# EAGLE design MintyCharger (Rev A) (EAGLE 7.7.0)
MintyCharger (Rev A)
AUTHOR: Nathan Campos; REVISION: A

## Sheet 1 of 2: Analog Section Contains the entire analog part of the circuit, including sensing, DC/DC boost conversion, and an adjustable DC load.
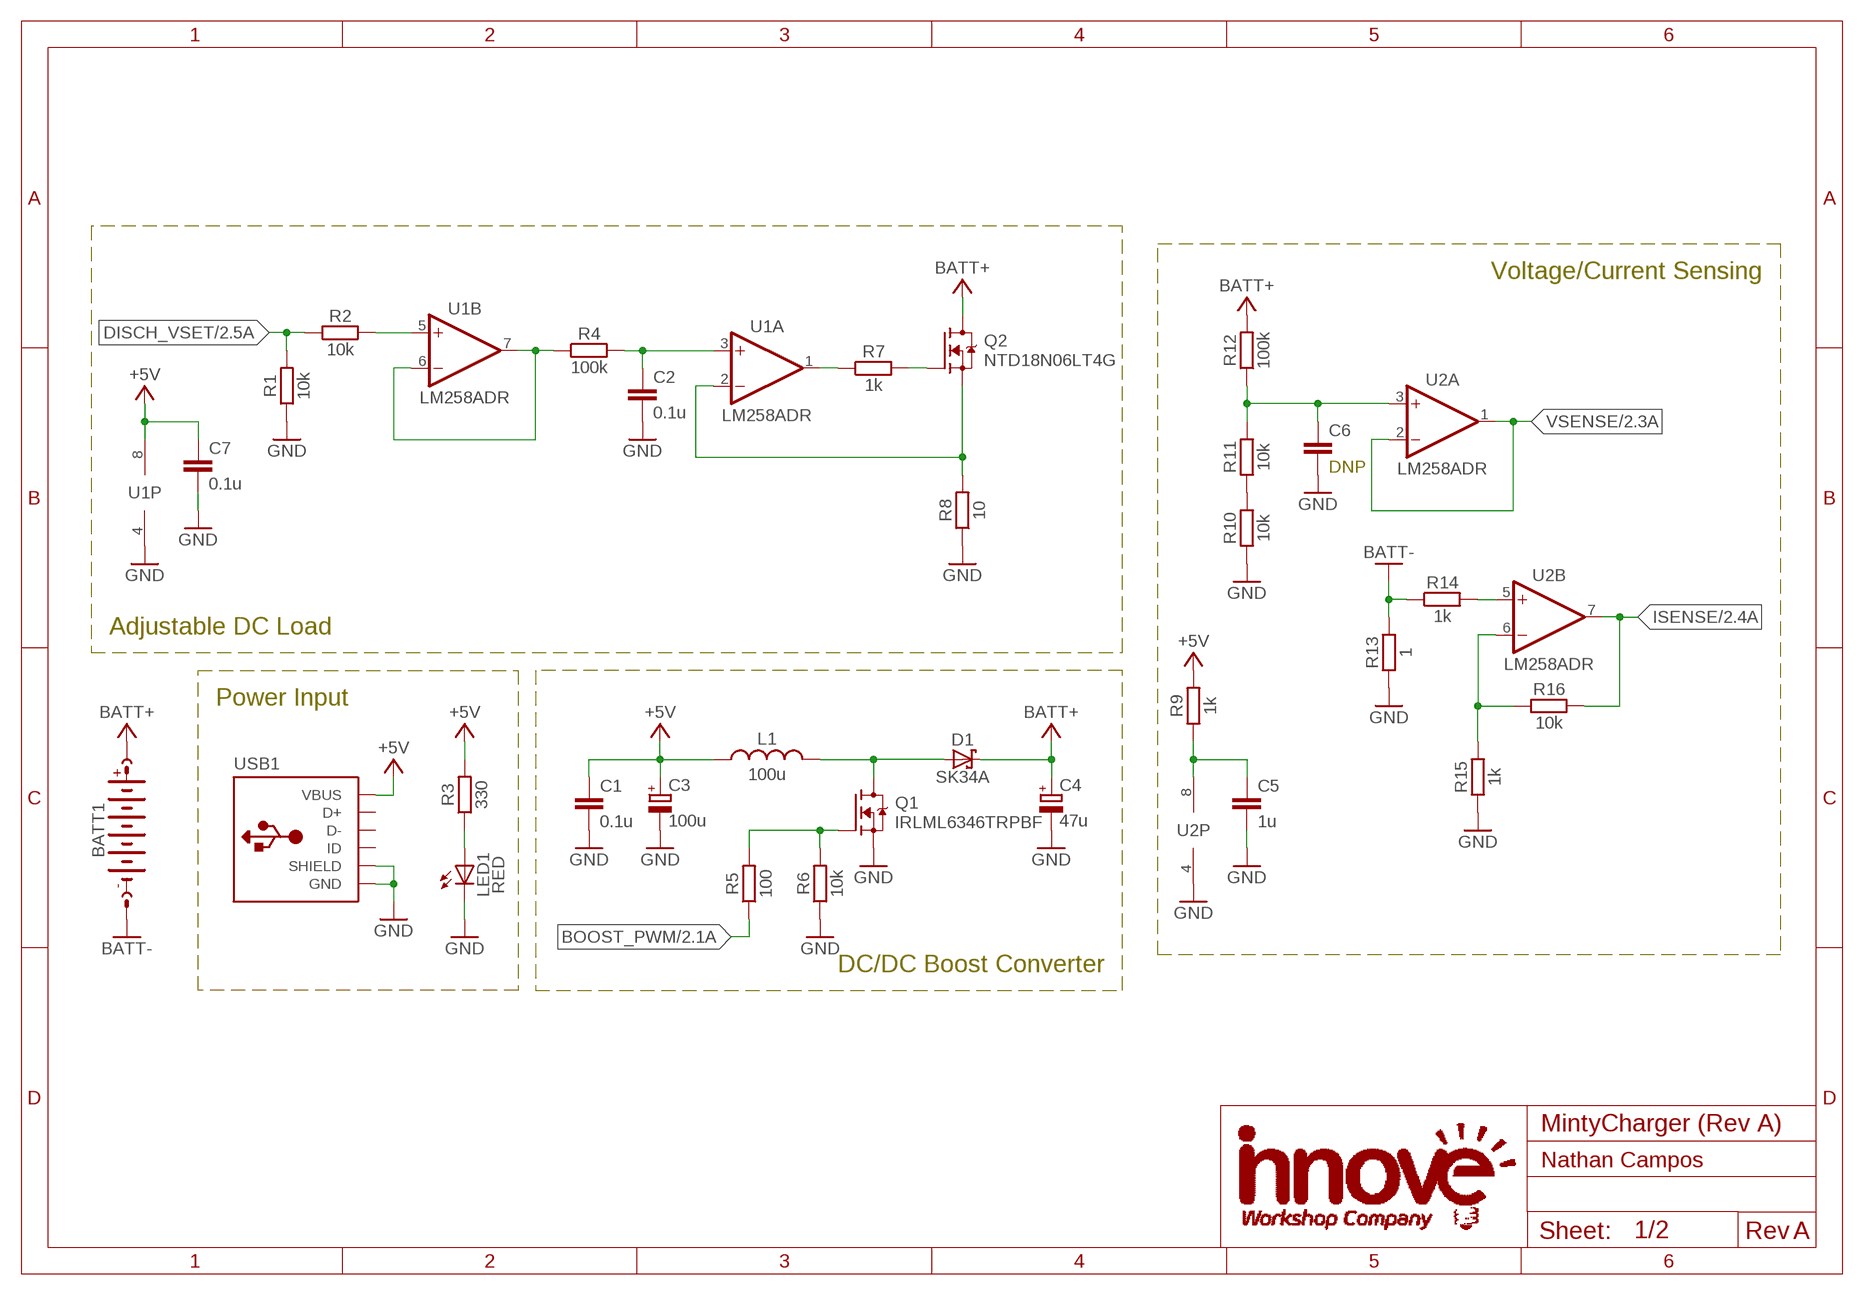
[diagram p0: schematic, sheet 1]

### Parts
BATT1  KEYSTONE-590-9V  [KEYSTONE-590-9V]
C1  0.1u  C0805  [C0805]
C2  0.1u  C0805  [C0805]
C3  100u  CPOL-MCVVT016M101EA1L  [PANASONIC_D]
C4  47u  CPOL-MCVVT016M470DA1L  [PANASONIC_C]
C5  1u  C0805  [C0805]
C6  C0805  [C0805]
C7  0.1u  C0805  [C0805]
D1  SK34A  [SMA]
L1  100u  L-ELLCTP  [ELLCTP]
LED1  RED  LEDCHIP-LED0805  [CHIP-LED0805]
Q1  IRLML6346TRPBF  [SOT23]
Q2  NTD18N06LT4G  [TO252]
R1  10k  R0805  [R0805]
R2  10k  R0805  [R0805]
R3  330  R0805  [R0805]
R4  100k  R0805  [R0805]
R5  100  R0805  [R0805]
R6  10k  R0805  [R0805]
R7  1k  R0805  [R0805]
R8  10  R1206  [R1206]
R9  1k  R0805  [R0805]
R10  10k  R0805  [R0805]
R11  10k  R0805  [R0805]
R12  100k  R0805  [R0805]
R13  1  R1206  [R1206]
R14  1k  R0805  [R0805]
R15  1k  R0805  [R0805]
R16  10k  R0805  [R0805]
U1  LM258ADR  [SO08]
U2  LM258ADR  [SO08]
USB1  USB-MICRO-10118194-0001LF  [AMPHENOL_10118194-0001LF]

### Nets
+5V: C1.1 C3.+ C7.1 L1.P$1 R3.2 R9.2 U1.8(P:V+) USB1.VCC(VBUS) ; also sheet 2
BATT+: BATT1.P$+1(+) BATT1.P$+2(+) BATT1.P$+3(+) C4.+ D1.C Q2.3(D) R12.2
BATT-: BATT1.P$-1(-) BATT1.P$-2(-) BATT1.P$-3(-) R13.2 R14.1
BOOST_PWM: R5.1 ; also sheet 2
DISCH_VSET: R1.2 R2.1 ; also sheet 2
GND: C1.2 C2.2 C3.- C4.- C5.2 C6.2 C7.2 LED1.C Q1.2(S) R1.1 R6.1 R8.1 R10.1 R13.1 R15.1 U1.4(P:V-) U2.4(P:V-) USB1.GND USB1.S1(SHIELD) USB1.S2(SHIELD) USB1.S3(SHIELD) USB1.S4(SHIELD) USB1.S5(SHIELD) USB1.S6(SHIELD) USB1.S7(SHIELD) USB1.S8(SHIELD) ; also sheet 2
ISENSE: R16.2 U2.7(B:OUT) ; also sheet 2
N$1: R10.2 R11.1
N$2: C6.1 R11.2 R12.1 U2.3(A:+IN)
N$3: R15.2 R16.1 U2.6(B:-IN)
N$4: Q2.2(S) R8.2 U1.2(A:-IN)
N$5: C2.1 R4.2 U1.3(A:+IN)
N$6: R4.1 U1.6(B:-IN) U1.7(B:OUT)
N$7: R2.2 U1.5(B:+IN)
N$8: Q2.1(G) R7.2
N$9: R7.1 U1.1(A:OUT)
N$10: R14.2 U2.5(B:+IN)
N$11: C5.1 R9.1 U2.8(P:V+)
N$12: D1.A L1.P$2 Q1.3(D)
N$13: Q1.1(G) R5.2 R6.2
N$14: LED1.A R3.1
VSENSE: U2.1(A:OUT) U2.2(A:-IN) ; also sheet 2
Unconnected: USB1.D+ USB1.D- USB1.ID

### Notes on the sheet
- Voltage/Current Sensing
- DNP
- Adjustable DC Load
- Power Input
- DC/DC Boost Converter

## Sheet 2 of 2: Digital Section Includes the microcontroller, its programming port, shift registers and a whole bunch of LEDs.
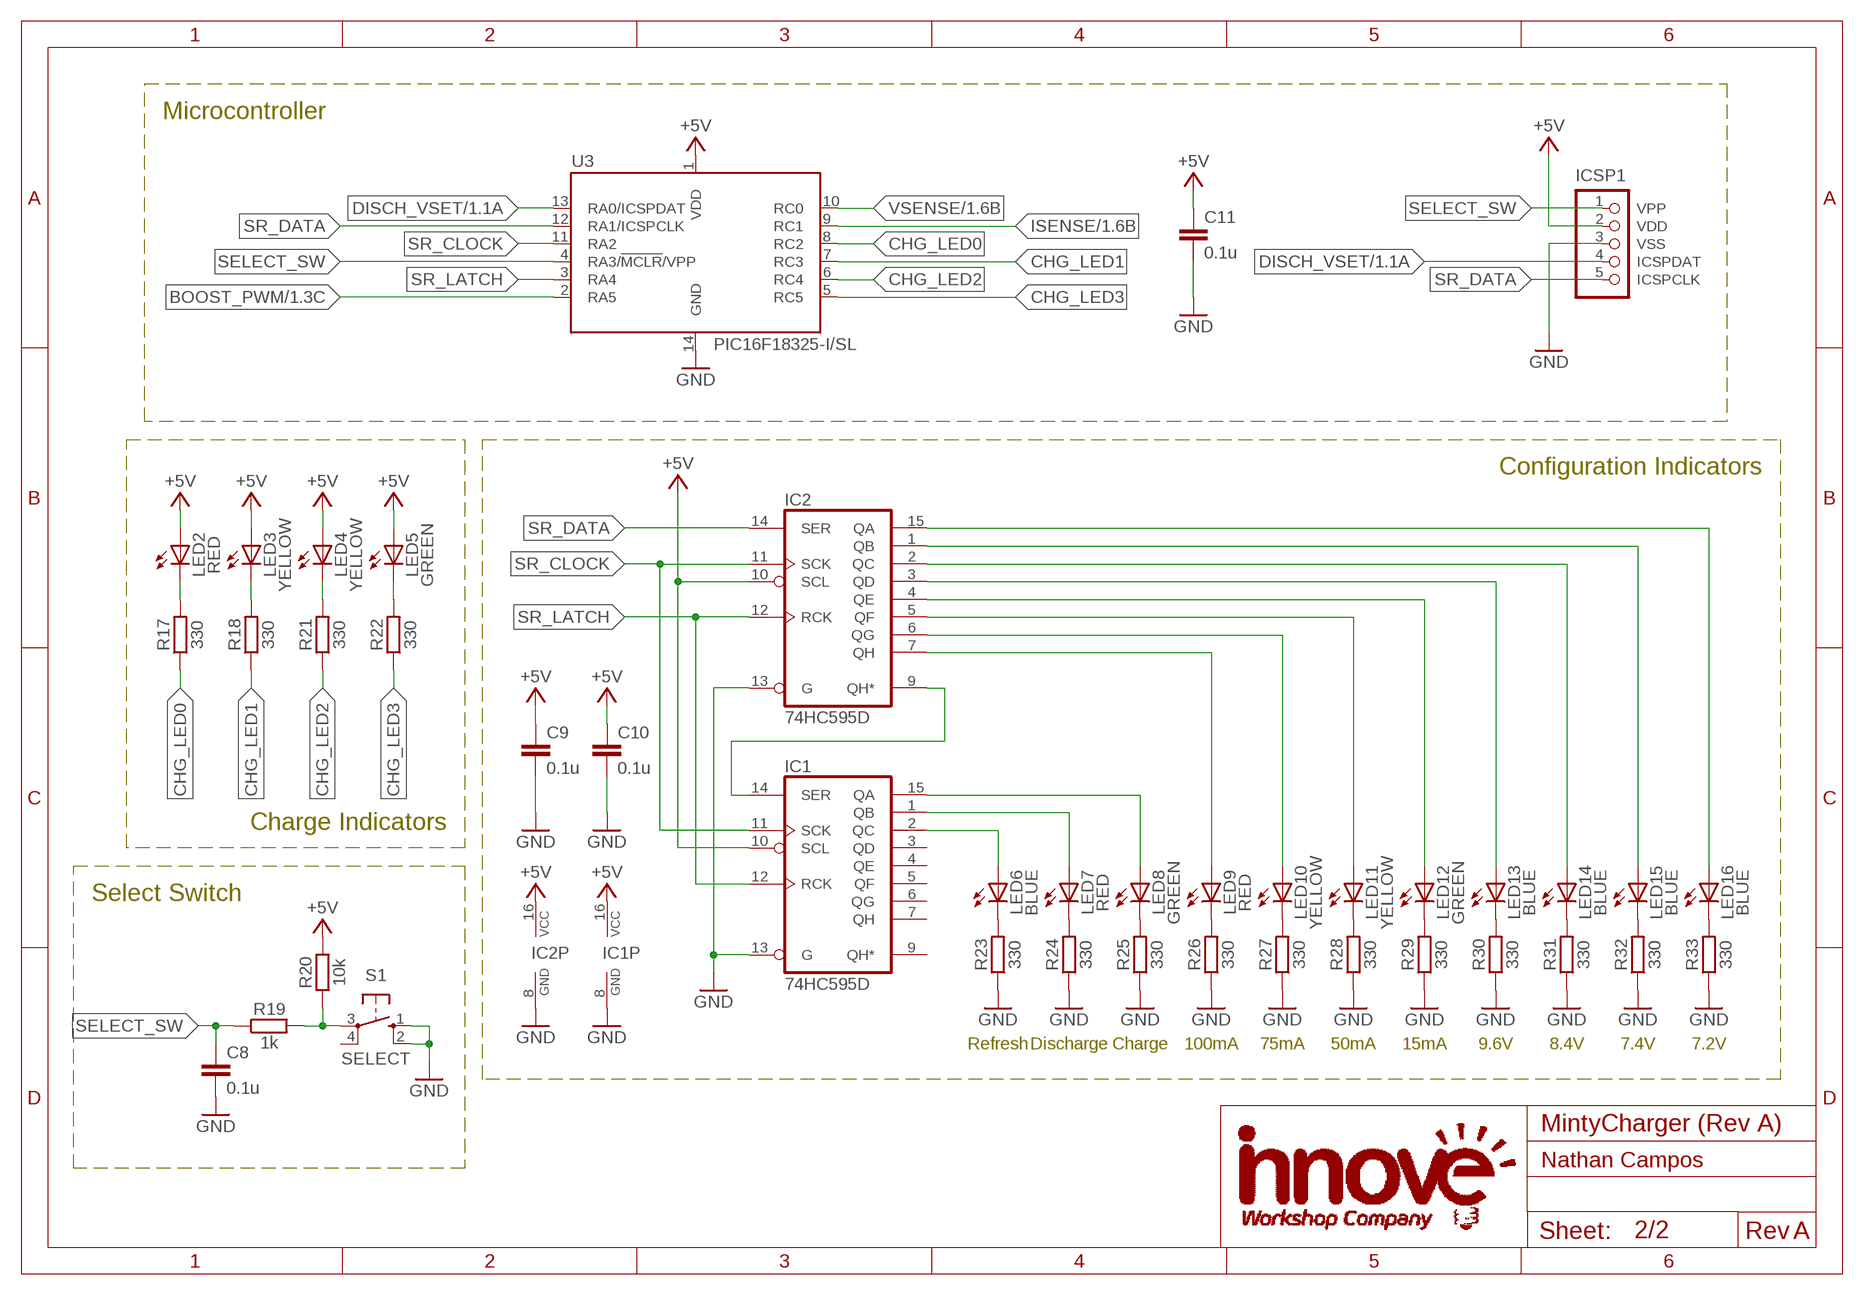
[diagram p1: schematic, sheet 2]

### Parts
C8  0.1u  C0805  [C0805]
C9  0.1u  C0805  [C0805]
C10  0.1u  C0805  [C0805]
C11  0.1u  C0805  [C0805]
IC1  74HC595D  [SO16]
IC2  74HC595D  [SO16]
ICSP1  PIC-ICSPJST-XH  [B5B-XH-A]
LED2  RED  LEDCHIP-LED0805  [CHIP-LED0805]
LED3  YELLOW  LEDCHIP-LED0805  [CHIP-LED0805]
LED4  YELLOW  LEDCHIP-LED0805  [CHIP-LED0805]
LED5  GREEN  LEDCHIP-LED0805  [CHIP-LED0805]
LED6  BLUE  LEDCHIP-LED0805  [CHIP-LED0805]
LED7  RED  LEDCHIP-LED0805  [CHIP-LED0805]
LED8  GREEN  LEDCHIP-LED0805  [CHIP-LED0805]
LED9  RED  LEDCHIP-LED0805  [CHIP-LED0805]
LED10  YELLOW  LEDCHIP-LED0805  [CHIP-LED0805]
LED11  YELLOW  LEDCHIP-LED0805  [CHIP-LED0805]
LED12  GREEN  LEDCHIP-LED0805  [CHIP-LED0805]
LED13  BLUE  LEDCHIP-LED0805  [CHIP-LED0805]
LED14  BLUE  LEDCHIP-LED0805  [CHIP-LED0805]
LED15  BLUE  LEDCHIP-LED0805  [CHIP-LED0805]
LED16  BLUE  LEDCHIP-LED0805  [CHIP-LED0805]
R17  330  R0805  [R0805]
R18  330  R0805  [R0805]
R19  1k  R0805  [R0805]
R20  10k  R0805  [R0805]
R21  330  R0805  [R0805]
R22  330  R0805  [R0805]
R23  330  R0805  [R0805]
R24  330  R0805  [R0805]
R25  330  R0805  [R0805]
R26  330  R0805  [R0805]
R27  330  R0805  [R0805]
R28  330  R0805  [R0805]
R29  330  R0805  [R0805]
R30  330  R0805  [R0805]
R31  330  R0805  [R0805]
R32  330  R0805  [R0805]
R33  330  R0805  [R0805]
S1  SELECT  TACT-4PIN-SMT  [PTS645-SMT]
U3  PIC16F18325-I/SL  [SO14]

### Nets
+5V: C9.1 C10.1 C11.1 IC1.10(SCL) IC1.16(VCC) IC2.10(SCL) IC2.16(VCC) ICSP1.2(VDD) LED2.A LED3.A LED4.A LED5.A R20.2 U3.1(VDD) ; also sheet 1
BOOST_PWM: U3.2(RA5) ; also sheet 1
CHG_LED0: R17.1 U3.8(RC2)
CHG_LED1: R18.1 U3.7(RC3)
CHG_LED2: R21.1 U3.6(RC4)
CHG_LED3: R22.1 U3.5(RC5)
DISCH_VSET: ICSP1.4(ICSPDAT) U3.13(RA0/ICSPDAT) ; also sheet 1
GND: C8.2 C9.2 C10.2 C11.2 IC1.8(GND) IC1.13(G) IC2.8(GND) IC2.13(G) ICSP1.3(VSS) R23.1 R24.1 R25.1 R26.1 R27.1 R28.1 R29.1 R30.1 R31.1 R32.1 R33.1 S1.1(S) S1.2(S1) U3.14(GND) ; also sheet 1
ISENSE: U3.9(RC1) ; also sheet 1
N$15: LED5.C R22.2
N$16: LED4.C R21.2
N$17: LED3.C R18.2
N$18: LED2.C R17.2
N$19: IC1.14(SER) IC2.9(QH*)
N$20: LED9.C R26.2
N$21: LED10.C R27.2
N$22: LED11.C R28.2
N$23: LED12.C R29.2
N$24: LED13.C R30.2
N$25: LED14.C R31.2
N$26: LED15.C R32.2
N$27: LED16.C R33.2
N$28: R19.2 R20.1 S1.3(P)
N$29: LED6.C R23.2
N$30: LED7.C R24.2
N$31: LED8.C R25.2
N$32: IC1.15(QA) LED8.A
N$33: IC1.1(QB) LED7.A
N$34: IC1.2(QC) LED6.A
N$36: IC2.7(QH) LED9.A
N$37: IC2.6(QG) LED10.A
N$38: IC2.5(QF) LED11.A
N$39: IC2.4(QE) LED12.A
N$40: IC2.3(QD) LED13.A
N$41: IC2.2(QC) LED14.A
N$42: IC2.1(QB) LED15.A
N$43: IC2.15(QA) LED16.A
SELECT_SW: C8.1 ICSP1.1(VPP) R19.1 U3.4(RA3/!MCLR!/VPP)
SR_CLOCK: IC1.11(SCK) IC2.11(SCK) U3.11(RA2)
SR_DATA: IC2.14(SER) ICSP1.5(ICSPCLK) U3.12(RA1/ICSPCLK)
SR_LATCH: IC1.12(RCK) IC2.12(RCK) U3.3(RA4)
VSENSE: U3.10(RC0) ; also sheet 1
Unconnected: IC1.3(QD) IC1.4(QE) IC1.5(QF) IC1.6(QG) IC1.7(QH) IC1.9(QH*) S1.4(P1)

### Notes on the sheet
- Microcontroller
- Configuration Indicators
- Charge Indicators
- Select Switch
- Refresh | Discharge | Charge | 100mA | 75mA | 50mA | 15mA | 9.6V | 8.4V | 7.4V | 7.2V

## Library data of the parts
BATT1 = innove-batteries:KEYSTONE-590-9V: Keystone 590 - Arranged for a 9V (PP3) Battery 9V Snap-In Spring Contact Source: https://www.farnell.com/cad/2291484.pdf
C1 C2 C5-C11 = innove-passives:C: Ceramic Capacitor Those little yellow/brown things
C3 C4 = innove-passives:CPOL: Polarized Capacitor May come in the electrolytic and tantalum variants
D1 = innove-diodes:SK34A: Schottky Rectifier - Taiwan Semiconductor SK34A Schottky Rectifier, 40 V, 3 A, Single, DO-214AC (SMA), 2 Pins, 550 mV Source: http://www.farnell.com/datasheets/2357945.pdf
IC1 IC2 = 74xx-eu:74*595: 8-bit SHIFT REGISTER, output latch
ICSP1 = innove-con-standard:PIC-ICSP: PIC In-Circuit Serial Programming Header The industry standard way to program a PIC microcontroller. Available with the following connectors: JST XH-5
L1 = innove-passives:L: Inductor The magic beans of the electronics world.
LED1-LED16 = innove-leds:LED: LED OSRAM: - CHIPLED LG R971, LG N971, LY N971, LG Q971, LY Q971, LO R971, LY R971 LH N974, LH R974 LS Q976, LO Q976, LY Q976 LO Q996 - Hyper CHIPLED LW Q18S LB Q993, LB Q99A, LB R99A - SideLED LS A670, LO A670, LY A670, LG A670, LP A670 LB A673, LV A673, LT A673, LW A673 LH A674 LY A675 LS A676, LA A676, LO A676, LY A676, LW A676 LS A679, LY A679, LG A679 - Hyper Micro SIDELED® LS Y876, LA Y876, LO Y876, LY Y876 LT Y87S - SmartLED LW L88C, LW L88S LB L89C, LB L89S, LG L890 LS L89K, LO L89K, LY L89K LS L896, LA L896, LO L896, LY L896 - TOPLED LS T670, LO T670, LY T670, LG T670, LP T670 LSG T670, LSP T670, LSY T670, LOP T670, LYG T670 LG T671, LOG T671, LSG T671 LB T673, LV T673, LT T673, LW T673 LH T674 LS T676, LA T676, LO T676, LY T676, LB T676, LH T676, LSB T676, LW T676 LB T67C, LV T67C, LT T67C, LS T67K, LO T67K, LY T67K, LW E67C LS E67B, LA E67B, LO E67B, LY E67B, LB E67C, LV E67C, LT E67C LW T67C LS T679, LY T679, LG T679 LS T770, LO T770, LY T770, LG T770, LP T770 LB T773, LV T773, LT T773, LW T773 LH T774 LS E675, LA E675, LY E675, LS T675 LS T776, LA T776, LO T776, LY T776, LB T776 LHGB T686 LT T68C, LB T68C - Hyper Mini TOPLED® LB M676 - Mini TOPLED Santana® LG M470 LS M47K, LO M47K, LY M47K Source: http://www.osram.convergy.de LUXEON: - LUMILED® LXK2-PW12-R00, LXK2-PW12-S00, LXK2-PW14-U00, LXK2-PW14-V00 LXK2-PM12-R00, LXK2-PM12-S00, LXK2-PM14-U00 LXK2-PE12-Q00, LXK2-PE12-R00, LXK2-PE12-S00, LXK2-PE14-T00, LXK2-PE14-U00 LXK2-PB12-K00, LXK2-PB12-L00, LXK2-PB12-M00, LXK2-PB14-N00, LXK2-PB14-P00, LXK2-PB14-Q00 LXK2-PR12-L00, LXK2-PR12-M00, LXK2-PR14-Q00, LXK2-PR14-R00 LXK2-PD12-Q00, LXK2-PD12-R00, LXK2-PD12-S00 LXK2-PH12-R00, LXK2-PH12-S00 LXK2-PL12-P00, LXK2-PL12-Q00, LXK2-PL12-R00 Source: www.luxeon.com KINGBRIGHT: KA-3528ASYC Source: www.kingbright.com
Q1 = innove-mosfets:IRLML6346TRPBF: IRLML6346TRPBF Power MOSFET, N Channel, 30 V, 3.4 A, 0.046 ohm, SOT-23, Surface Mount Source: http://www.farnell.com/datasheets/1911845.pdf
Q2 = innove-mosfets:NTD18N06LT4G: NTD18N06LT4G Power MOSFET, N Channel, 60 V, 18 A, 0.054 ohm, TO-252 (DPAK), Surface Mount Source: http://www.farnell.com/datasheets/2355009.pdf
R1-R33 = innove-passives:R: Resistor This is officially the most boring component ever.
S1 = innove-switches:TACT-4PIN: 4 Pin Tactile Switch The most ubiquitous kind of tactile switch.
U1 U2 = innove-opamps:LM258: LM258 Operational Amplifier, Dual, 2 Amplifier, 700 kHz, 0.3 V/µs, 3V to 32V, ± 1.5V to ± 16V Source: https://www.ti.com/product/LM258
U3 = innove-microcontrollers:PIC16F18325: Microchip PIC16F18325 PIC16F18325 microcontrollers feature Analog, Core Independent Peripherals and communication peripherals, combined with Extreme Low Power (XLP) for wide range of general purpose and low power applications. The Peripheral Pin Select (PPS) functionality enables pin mapping when using the digital peripherals (CLC, CWG, CCP, PWM and communications) to add flexibility to the application design. Additional Features: Enhanced Mid-range Core with 49 Instruction, 16 Stack Levels Flash Program Memory with self read/write capability 256B EEPROM IDLE and DOZE low power modes Peripheral Module Disable (PMD) Peripheral Pin Select (PPS) 2x 10-bit PWMs 4x Capture, Compare, PWM (CCP) 2x Complementary Waveform Generator (CWG) Module Numerically Controlled Oscillator (NCO) 4x Configurable Logic Controller (CLC) 15 Channel 10-bit ADC with Voltage Reference 5-bit Digital to Analog Converter (DAC) 2x Comparator 2x SPI/I2C Enhanced Universal Synchronous Asynchronous Receiver Transmitter (EUSART) 4x 8-bit Timers (TMR0/TMR2) 3x 16-bit Timer (TMR1) Extended Watchdog Timer (WDT) Enhanced Power-On/Off-Reset Low-Power Brown-Out Reset (LPBOR) Programmable Brown-Out Reset (BOR) In Circuit Serial Programming (ICSP) PIC16LF18325 (1.8V – 3.6V) PIC16F18325 (2.3V – 5.5V) Source: https://www.microchip.com/wwwproducts/en/PIC16F18325
USB1 = innove-con-usb:USB-MICRO: USB Micro Connector The most ubiquitous USB connector these days. Created by Nathan Campos

## Board
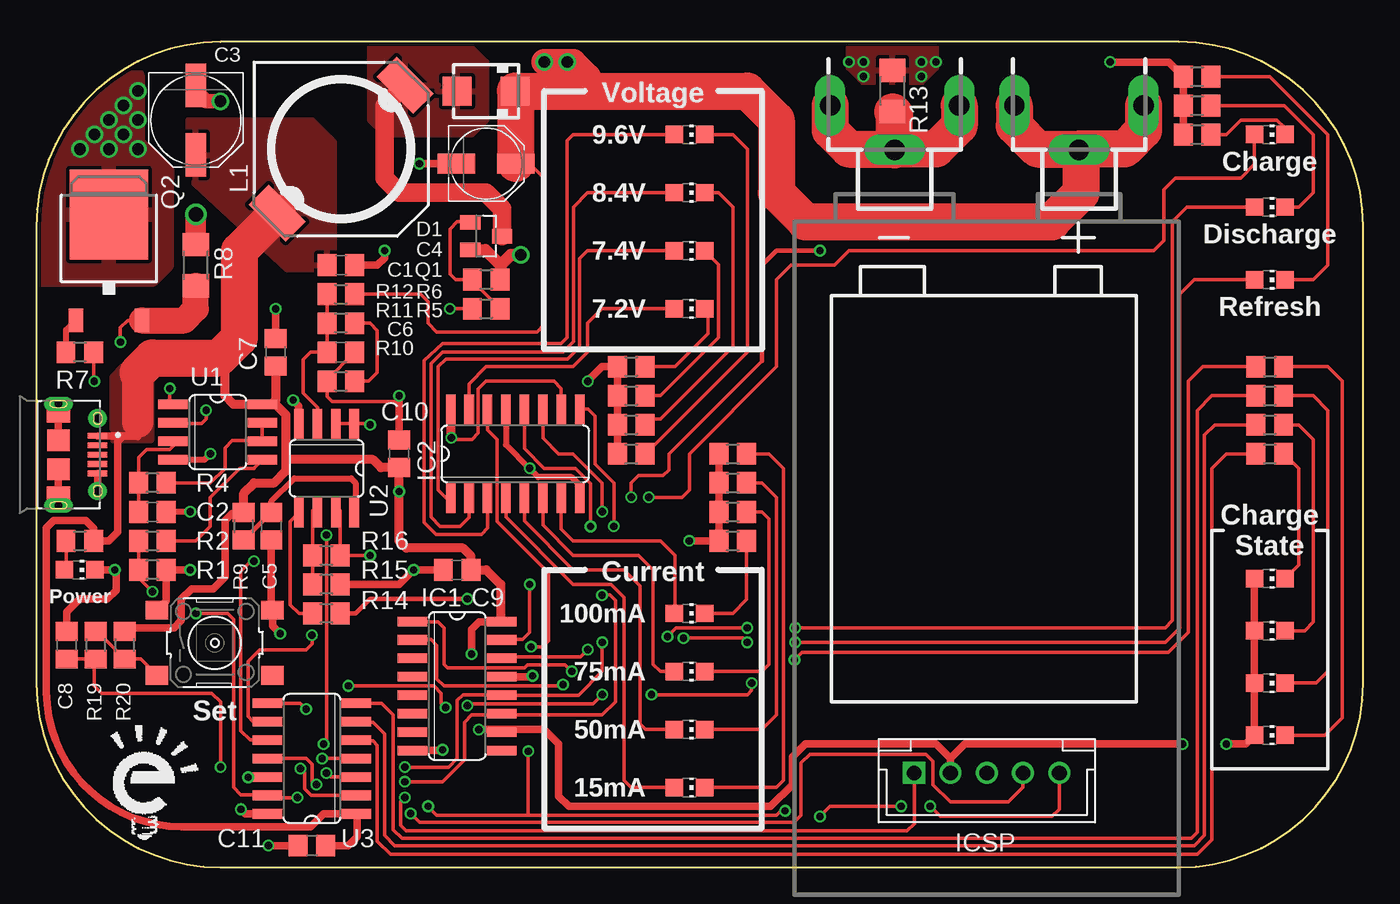
[diagram p2: board, top side]
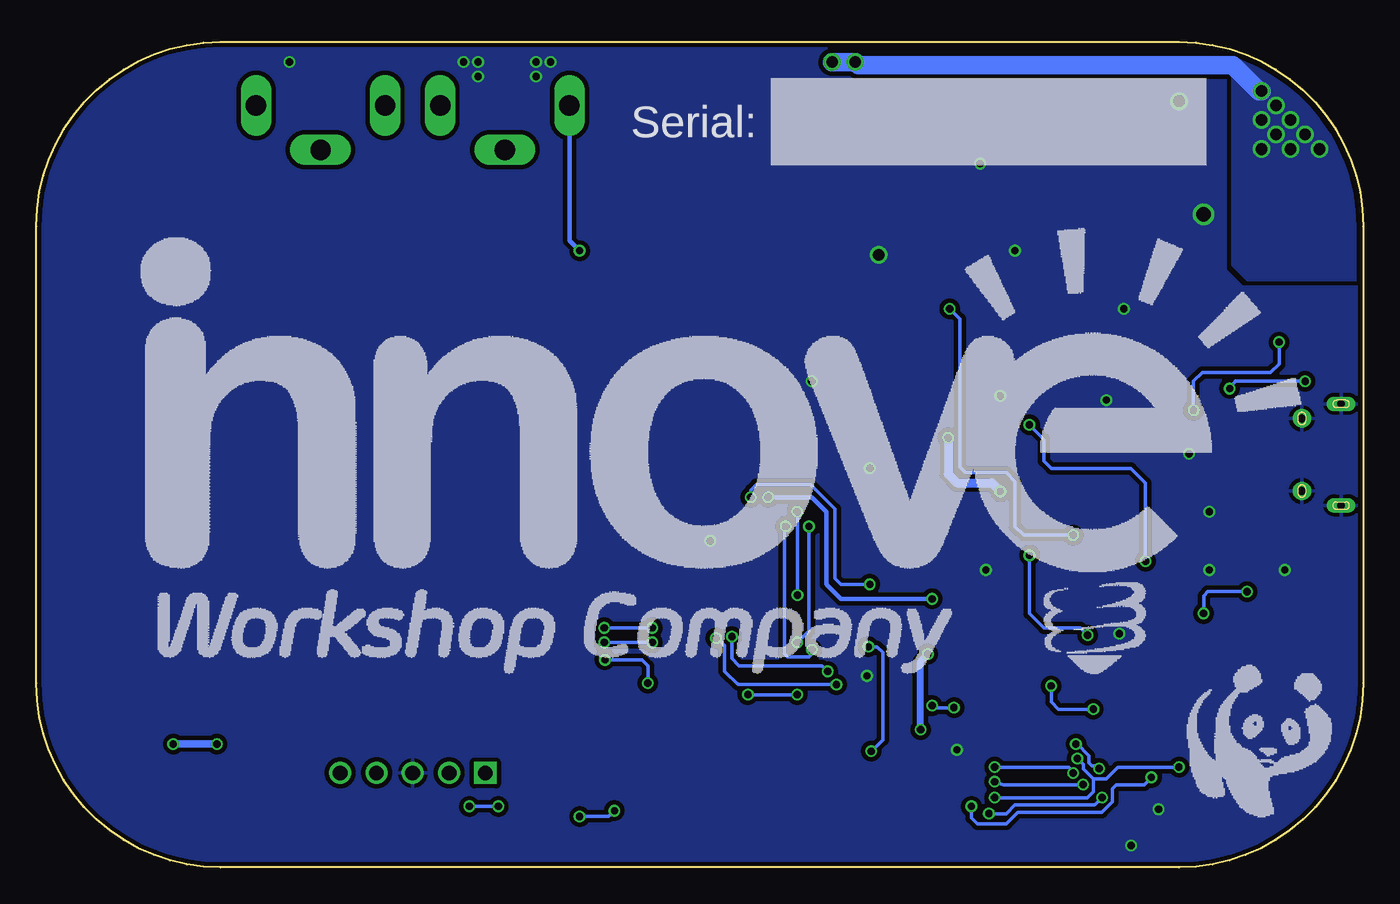
[diagram p3: board, bottom side, seen from below]

Size 91.44 x 56.9 mm. Coordinates in mm from the lower left corner, seen from the top.
Copper layers (1*16): Top 0.035mm / dielectric 1.5mm / Bottom 0.035mm
Design rules "seeedstudio-2layers": minimum track width 6mil, minimum drill 12mil, track to track 6mil, track to pad 6mil, pad to pad 6mil, via to via 6mil, smd to smd 0mil, copper to edge 10mil, drill to drill 10mil, minimum pad ring 10mil, minimum via ring 6mil, stop-mask expansion 2mil, vias tented up to drill 100mil, thermal gap 10mil

### Footprints (pad centres in the part's own frame; a part is rotated, then mirrored left to right if it is on the bottom)
KEYSTONE-590-9V = drill 1.4 long: P$+1 1.9,0; P$+2 10.8,0; P$+3 6.35,-3.05; P$-1 -10.8,0; P$-2 -1.9,0; P$-3 -6.35,-3.05
C0805 = smd 1.3 x 1.5: 1 -0.95,0; 2 0.95,0
PANASONIC_D = smd 3 x 1.4: + 2.4,0; - -2.4,0
PANASONIC_C = smd 2.6 x 1.4: + 2.05,0; - -2.05,0
SMA = smd 2 x 2: A 2,0; C -2,0
SO16 = smd 0.66 x 2.032: 1 -4.445,-3.073; 2 -3.175,-3.073; 3 -1.905,-3.073; 4 -0.635,-3.073; 5 0.635,-3.073; 6 1.905,-3.073; 7 3.175,-3.073; 8 4.445,-3.073; 9 4.445,3.073; 10 3.175,3.073; 11 1.905,3.073; 12 0.635,3.073; 13 -0.635,3.073; 14 -1.905,3.073; 15 -3.175,3.073; 16 -4.445,3.073
B5B-XH-A = drill 1.016 square: 1 -5,0 | drill 1.016: 2 -2.5,0; 3 0,0; 4 2.5,0; 5 5,0
ELLCTP = smd 1.95 x 3.6 rotated 45: P$1 -4.4,-4.4; P$2 4.4,4.4
CHIP-LED0805 = smd 1.2 x 1.2: A 0,-1.05; C 0,1.05
SOT23 = smd 1 x 1.4: 1 -0.95,-1.1; 2 0.95,-1.1; 3 0,1.1
TO252 = smd 1 x 1.6: 1 -2.28,-4.8; 2 2.28,-4.8 | smd 5.4 x 6.2: 3 0,2.5
R0805 = smd 1.3 x 1.5: 1 -0.95,0; 2 0.95,0
R1206 = smd 1.6 x 1.803: 1 -1.422,0; 2 1.422,0
PTS645-SMT = smd 1.55 x 1.3: 1 -3.975,2.25; 2 3.975,2.25; 3 -3.975,-2.25; 4 3.975,-2.25
SO08 = smd 0.66 x 2.032: 1 -1.905,-3.073; 2 -0.635,-3.073; 3 0.635,-3.073; 4 1.905,-3.073; 5 1.905,3.073; 6 0.635,3.073; 7 -0.635,3.073; 8 -1.905,3.073
SO14 = smd 0.66 x 2.032: 1 -3.81,-3.073; 2 -2.54,-3.073; 3 -1.27,-3.073; 4 0,-3.073; 5 1.27,-3.073; 6 2.54,-3.073; 7 3.81,-3.073; 8 3.81,3.073; 9 2.54,3.073; 10 1.27,3.073; 11 0,3.073; 12 -1.27,3.073; 13 -2.54,3.073; 14 -3.81,3.073
AMPHENOL_10118194-0001LF = smd 0.4 x 1.35: D+ 0,2.7; D- -0.65,2.7; GND 1.3,2.7; ID 0.65,2.7; VCC -1.3,2.7 | drill 0.55 pad 1.27: S1 -2.5,2.7; S2 2.5,2.7 | drill 0.5 long: S3 -3.5,0; S6 3.5,0 | smd 1.5 x 1.55: S4 -1,0; S5 1,0 | smd 1 x 1.6: S7 -2.7,0; S8 2.7,0

### Placement (x,y rotation side)
BATT1  65.5,52.51 0 top
C1  21,41.51 0 top
C2  8,24.51 0 top
C3  11,51.51 270 top
C4  31,48.51 0 top
C5  16.2,23.51 270 top
C6  21,35.51 0 top
C7  16.5,35.51 90 top
C8  2.1,15.31 90 top
C9  29,20.51 180 top
C10  25,28.51 90 top
C11  19,1.51 180 top
D1  31,53.51 180 top
IC1  29,12.51 270 top
IC2  33,28.51 0 top
ICSP1  65.5,6.51 0 top
L1  21,49.51 0 top
LED1  3,20.51 270 top
LED2  85,9.11 270 top
LED3  85,12.71 270 top
LED4  85,16.31 270 top
LED5  85,19.91 270 top
LED6  85,40.51 270 top
LED7  85,45.51 270 top
LED8  85,50.51 270 top
LED9  45,17.51 270 top
LED10  45,13.51 270 top
LED11  45,9.51 270 top
LED12  45,5.51 270 top
LED13  45,50.51 270 top
LED14  45,46.51 270 top
LED15  45,42.51 270 top
LED16  45,38.51 270 top
Q1  31,43.51 270 top
Q2  5,42.51 0 top
R1  8,20.51 180 top
R2  8,22.51 0 top
R3  3,22.51 0 top
R4  8,26.51 180 top
R5  31,38.51 0 top
R6  31,40.51 180 top
R7  3,35.51 180 top
R8  11,41.51 270 top
R9  14.3,23.51 90 top
R10  21,33.51 0 top
R11  21,37.51 180 top
R12  21,39.51 0 top
R13  59,53.51 270 top
R14  20,17.51 180 top
R15  20,19.51 180 top
R16  20,21.51 0 top
R17  85,34.51 0 top
R18  85,32.51 0 top
R19  4.1,15.31 90 top
R20  6.1,15.31 90 top
R21  85,30.51 0 top
R22  85,28.51 0 top
R23  80,54.51 0 top
R24  80,52.51 0 top
R25  80,50.51 0 top
R26  48,22.51 0 top
R27  48,24.51 0 top
R28  48,26.51 0 top
R29  48,28.51 0 top
R30  41,28.51 0 top
R31  41,30.51 0 top
R32  41,32.51 0 top
R33  41,34.51 0 top
S1  12.3,15.48 0 top
U1  12.5,30.01 270 top
U2  20,27.51 180 top
U3  19,7.51 90 top
U$1  [ALTOIDSTIN-DIM]  45.72,28.45 0 top
USB1  1.52,28.45 270 top

### Tracks (layer width: path | path; a pad name or v marks a point on that pad's centre or on a via)
+5V  (via drill 0.5)
  Top 0.254: IC2.10 36.16,31.6 36.16,33.02 35.66,33.51 31,33.51 30.45,32.96 30.45,29.94 30.02,29.51 28.7,29.51 v28.6,29.61 | 32.02,17.01 IC1.16 | 32.25,9.51 IC1.10
  Top 0.508: USB1.VCC 6,29.75 | 6,29.75 6.96,29.75 | 6.96,29.75 7,29.71 | 7,30.71 7,29.79 6.96,29.75 | LED5.A LED4.A LED3.A LED2.A 83.35,8.51 v82,8.51 | 13,34.71 12.6,35.11 | 15.9,31.91 15.1,31.91 U1.8 | R9.2 14.25,24.41 13.5,24.41 13,23.91 13,20.01 12.2,19.21 10.7,19.21 10,18.51 10,17.01 9.5,16.51 6.35,16.51 R20.2 6.25,16.11 | v30.5,9.51 32.25,9.51 35,9.51 36,8.51 36,4.91 36.7,4.21 50.6,4.21 52.1,5.71 52.1,7.61 53,8.51 62,8.51 63,7.51 | v30,14.71 30,16.41 30.5,16.91 32.03,16.91 IC1.16 | 63,7.51 ICSP1.2 | 63,7.51 64,8.51 v79,8.51 | 6,29.75 5.6,29.35 5.6,23.11 5,22.51 R3.2 3.95,23.36 3.4,23.91 1.2,23.91 0.7,23.41 0.7,12.11 arc90 10,2.81 18.9,2.81 19.79,3.7 U3.1 22.1,3.67 22.1,2.11 21.5,1.51 C11.1
  Top 0.61: IC1.16 32,17.03 32,19.51 31,20.51 C9.1 29.95,21.46 29.4,22.01 25.5,22.01 25,22.51 v25,25.91 C10.1 23.75,27.56 23.2,28.11 17.3,28.11 17.2,28.01 | IC2.16 28.55,29.65 v28.6,29.61 | 13,34.71 13,32.51 13.59,31.91 U1.8 16.2,31.91 | R9.2 14.3,25.81 15,26.51 16.4,26.51 17.2,27.31 17.2,28.01 | C7.1 16.5,32.21 16.2,31.91 | 16.2,31.91 16.5,31.91 17.2,31.21 17.2,28.01
  Top 2.184: 7,34.11 7,30.71
  Top 2.54: 7,34.11 8,35.11 12.6,35.11 14,36.51 14,42.51 L1.P$1
  Bottom 0.483: v30.5,9.51 30.5,14.21 v30,14.71
  Bottom 0.508: v79,8.51 v82,8.51
  Bottom 0.61: v28.6,29.61 28.6,27.11 28,26.51 25.6,26.51 v25,25.91
  pour Top: 10.5,51.51 19,51.51 20.5,50.01 20.5,41.21 17.3,41.21 10.5,47.51
  pour Top: 7.9,33.51 7.9,29.51 5.3,29.51 5.3,33.81 6,34.51
BATT+  (via drill 0.8)
  Top 0.254: C4.+ 34,48.51 35,47.51 35,37.41 34.5,36.91 27.6,36.91 27,37.51 27,39.01 26.5,39.51 R12.2
  Top 1.778: D1.C 37,53.51 38,54.51 37,55.51 v35,55.51
  Top 2.54: BATT1.P$+1 67.4,51.11 69,49.51 71.9,49.51 | BATT1.P$+2 76.3,50.81 75,49.51 71.9,49.51 | 71.9,49.51 BATT1.P$+3 72,49.31 72,46.51 70,44.51 53,44.51 51,46.51 51,51.51 49,53.51 D1.C 33.05,53.46 C4.+
  Bottom 1.27: v7,53.51 7.2,53.51 9,55.31 34.8,55.31 v35,55.51 v36.6,55.51
  other vias: 6,52.51 7,51.51 6,50.51 5,51.51 4,50.51 3,49.51 5,49.51 7,49.51
  pour Top: 0,40.51 8,40.51 9,41.51 9,47.51 7,49.51 7,54.51 6,56.51 0,50.51
  pour Bottom (isolate 0.406): 0,40.51 8,40.51 9,41.51 9,56.51 6,56.51 0,50.51
  pour Top: 7,50.51 9.4,48.11 9.4,47.51 8,47.51 8,48.51 7,48.51
BATT-  (via drill 0.5)
  Top 0.254: v41,25.51 41,26.51 41.5,27.01 43.2,27.01 43.6,27.41 43.6,28.51 50,34.91
  Top 0.305: v54,42.51 51,42.51 50,41.51 50,34.91 | v29.7,18.51 23,18.51 22,17.51 R14.1
  Top 2.54: BATT1.P$-3 59.15,51.94 R13.2 | BATT1.P$-1 54.7,50.81 56,49.51 59.1,49.51 BATT1.P$-3 | BATT1.P$-2 63.6,51.11 62,49.51 59.2,49.51 BATT1.P$-3
  Bottom 0.305: BATT1.P$-1 54.7,43.21 v54,42.51 | v41,25.51 38,25.51 37,24.51 37,19.51 36,18.51 v29.7,18.51
BOOST_PWM  (via drill 0.5)
  Top 0.254: R5.1 v28.5,38.51 | U3.2 18.94,4.97 18.5,5.41 18.5,6.51 v18.2,6.81 | v19.8,8.51 19.8,8.61 20,8.81 v20,22.91
  Bottom 0.254: v28.5,38.51 27.8,37.81 27.8,27.61 27.4,27.21 24.6,27.21 24,26.61 24,23.51 23.4,22.91 v20,22.91 | v19.8,8.51 19.7,8.51 18.9,7.71 18.9,7.21 18.7,7.01 18.4,7.01 v18.2,6.81
CHG_LED0  (via drill 0.5)
  Top 0.254: R17.1 80.4,34.51 79.4,33.51 79.4,16.21 78,14.81 52.75,14.81 v52.25,14.31 | U3.8 18.19,11.32 v18.6,10.91 | v21.5,12.51 27.4,12.51 27.9,12.01 27.9,11.31 v28.2,11.01 | v42.4,11.91 49,11.91 49.3,12.21 v49.3,12.71 49.3,12.51 | v29.7,11.16 29.8,11.26 38.35,11.26 v39,11.91
  Bottom 0.254: v18.6,10.91 21,10.91 21.5,11.41 v21.5,12.51 | v39,11.91 v42.4,11.91 | v28.2,11.01 29.55,11.01 v29.7,11.16 | v52.25,14.31 49.7,14.31 49.3,13.91 v49.3,12.71
CHG_LED1
  Top 0.254: R18.1 81,32.51 80,31.51 80,2.41 79.6,2.01 25.2,2.01 24.6,2.61 24.6,10.51 23.8,11.31 21.61,11.31 U3.7
CHG_LED2
  Top 0.254: R21.1 81.2,30.51 80.5,29.81 80.5,2.21 79.8,1.51 24.7,1.51 24,2.21 24,9.21 23.2,10.01 21.64,10.01 U3.6
CHG_LED3
  Top 0.254: R22.1 82,28.51 81,27.51 81,1.91 80,0.91 24.4,0.91 23.5,1.81 23.5,8.41 23.2,8.71 21.67,8.71 U3.5
DISCH_VSET  (via drill 0.5)
  Top 0.254: ICSP1.4 68,5.51 67,4.51 63,4.51 61.8,5.71 61.8,7.31 61.3,7.81 53.3,7.81 52.7,7.21 52.7,3.61 52.2,3.11 26.4,3.11 v25.8,3.71 | v18,4.81 16.56,4.81 U3.13 16.44,5.01 14.1,5.01 13.6,5.51 13.6,17.11 13.2,17.51 v11,17.51 | v8,19.01 7.05,19.96 R1.2 R2.1
  Bottom 0.254: v25.8,3.71 24.6,3.71 24,4.31 18.5,4.31 v18,4.81 | v8,19.01 10.7,19.01 11,18.71 v11,17.51
GND  (via drill 0.5, 0.8, 1)
  Top 0.254: C6.2 20.05,33.61 R10.1 20.05,32.46 20.4,32.11 24.9,32.11 25,32.01
  Top 0.406: v10.6,24.51 C2.2 | U1.4 11.59,28.1 v12,28.51 | IC2.8 37.44,26.36 36.9,26.91 34.6,26.91 v34,27.51 32.36,29.14 IC2.13
  Top 0.508: C10.2 25,32.01 v25,32.51 | C9.2 v26,20.51 25,19.51 R15.1 | IC1.8 27.95,8.06 v28,8.11 | v74,55.51 78.05,55.51 R23.1 R24.1 R25.1 | R29.1 R28.1 R27.1 R26.1 v45,22.51 | R30.1 R31.1 R32.1 R33.1 39,34.51 v38,33.51 | C7.2 v16.5,38.51 | C1.2 23.5,41.51 24,42.01 v24,42.51 | v10.6,20.51 R1.1 8.95,18.35 S1.1 | C5.2 16.2,17.8 S1.2 16.27,16.63 v16.8,16.11 | IC1.13 34.13,13.14 v34.2,13.21 | LED1.C v5.4,20.51 5.5,20.41 5.5,19.11 4.9,18.51 3,18.51 2.1,17.61 C8.2 | C11.2 v16,1.51 | U3.14 14.41,3.7 v14.1,4.01 | USB1.GND USB1.S2 | USB1.S5 USB1.S8 USB1.S6 | USB1.S4 USB1.S7 USB1.S3 | U2.4 18.09,31.81 v17.7,32.21 | C4.- v26.4,48.51
  Top 0.813: Q1.2 30.95,42.56 32,41.51 | 32,41.51 32,40.56 R6.1 | v33.4,42.21 32.7,42.21 32,41.51
  Top 1.016: v12.7,52.81 11.7,52.81 11,53.51 C3.-
  Top 1.422: R8.1 v11,45.01
  other vias: 56,55.51 57,55.51 57,54.51 61,54.51 61,55.51 62,55.51
  pour Top: 56,56.51 62,56.51 62,55.11 61,54.11 57,54.11 56,55.11
  pour Bottom (isolate 0.305, rank 6): 7.7,58.41 83.7,58.41 92.7,49.41 92.7,7.41 83.7,-1.59 7.7,-1.59 -1.3,7.41 -1.3,49.41
ISENSE  (via drill 0.5)
  Top 0.254: U2.7 20.95,24.59 R16.2 v23,21.51 | U3.9 14.96,10.05 14.6,10.41 14.6,14.21 15.4,15.01 18.6,15.01 19,15.41 v19,16.01
  Bottom 0.254: v23,21.51 23,17.51 22,16.51 19.5,16.51 v19,16.01
N$1
  Top 0.254: R10.2 22.9,33.51 23.5,34.11 23.5,37.01 23,37.51 R11.1
N$2
  Top 0.254: R12.1 R11.2 C6.1 18.9,35.51 18.4,35.01 18.4,32.71 19.4,31.71 19.4,30.14 U2.3
N$3
  Top 0.254: U2.6 19.05,24.59 R16.1 R15.2
N$4  (via drill 0.5)
  Top 0.254: 10.2,37.71 7.3,37.71 | 10.03,30.51 U1.2 9.93,30.61 11.4,30.61 11.7,30.91 v11.7,31.51 | v5.8,36.21 5.8,37.21 6.3,37.71 Q2.2
  Top 1.778: Q2.2 10.2,37.71 11,38.51 R8.2
  Bottom 0.254: v5.8,36.21 5.8,34.71 6.4,34.11 11.1,34.11 11.7,33.51 v11.7,31.51
N$5
  Top 0.254: C2.1 R4.2 7.05,28.26 7.6,28.81 9.2,28.81 9.43,29.04 U1.3
N$6
  Top 0.254: R4.1 12,26.51 13,27.51 13,28.91 13.5,29.41 15.06,29.41 U1.6 U1.7
N$7
  Top 0.254: R2.2 11,22.51 12,23.51 12,25.51 14,27.51 15,27.51 15.1,27.61 U1.5
N$8
  Top 0.406: R7.2 2.05,37.04 Q2.1
N$9  (via drill 0.5)
  Top 0.254: R7.1 3.95,33.56 v4,33.51 | v9.2,33.01 9.2,32.14 U1.1
  Bottom 0.254: v4,33.51 8.8,33.51 v9.2,33.01
N$10
  Top 0.254: R14.2 18.1,17.51 17.5,18.11 17.5,23.84 U2.5
N$11
  Top 0.305: R9.1 C5.1
  Top 0.406: C5.1 16.2,25.21 17.8,26.81 21.7,26.81 22,26.51 22,25 U2.8
N$12
  Top 1.27: Q1.3 32.1,45.41 31,46.51 25,46.51 24,47.51 24,52.51 L1.P$2
  pour Top: 23,56.51 30,56.51 31,55.51 31,51.51 30,50.51 24,50.51 23,51.51
N$13
  Top 0.254: R5.2 30.05,40.41 R6.2 28.9,40.51 28.5,40.91 28.5,44.01 29,44.51 29.85,44.51 Q1.1
N$14
  Top 0.254: R3.1 2.05,20.61 LED1.A
N$15
  Top 0.254: 86.05,19.56 LED5.C 87,20.86 87,27.51 86,28.51 R22.2
N$16
  Top 0.254: R21.2 87,30.51 88,29.51 88,16.91 87.4,16.31 LED4.C
N$17
  Top 0.254: R18.2 88,32.51 89,31.51 89,13.51 88.2,12.71 LED3.C
N$18
  Top 0.254: R17.2 89,34.51 90,33.51 90,10.31 88.8,9.11 LED2.C
N$19  (via drill 0.5)
  Top 0.254: IC2.9 38.03,31.58 38.5,31.11 38.5,27.81 39.8,26.51 v39.8,23.51 | IC1.14 32.17,14.51 37.5,14.51 v38,15.01
  Bottom 0.254: v38,15.01 38,14.71 38.21,14.5 39.67,14.5 39.88,14.71 39.88,23.43 v39.8,23.51
N$20
  Top 0.254: R26.2 48.95,18.46 48,17.51 LED9.C
N$21
  Top 0.254: R27.2 50,24.51 50.5,24.01 50.5,14.01 50,13.51 LED10.C
N$22
  Top 0.254: R28.2 50,26.51 51,25.51 51,10.51 50,9.51 LED11.C
N$23
  Top 0.254: R29.2 50.5,28.51 51.5,27.51 51.5,6.01 51,5.51 LED12.C
N$24
  Top 0.254: LED13.C 48,50.51 49,49.51 49,35.51 42,28.51 R30.2
N$25
  Top 0.254: LED14.C 47,46.51 48,45.51 48,35.91 43,30.91 42.35,30.91 R31.2 42,30.51
N$26
  Top 0.254: LED15.C 47,41.56 47,36.51 43,32.51 R32.2
N$27
  Top 0.254: R33.2 44,34.51 46.3,36.81 46.3,38.26 LED16.C 46,38.46
N$28
  Top 0.254: R19.2 4.2,16.26 R20.1 7.2,14.36 S1.3 | 8.4,13.3 S1.3 | 8.04,13.51 S1.3
N$29
  Top 0.254: R23.2 85,54.51 89,50.51 89,41.51 88,40.51 LED6.C
N$30
  Top 0.254: R24.2 86,52.51 88,50.51 88,46.51 87,45.51 LED7.C
N$31
  Top 0.254: R25.2 82,50.51 83,51.51 85.5,51.51 86,51.01 86,50.56 LED8.C
N$32  (via drill 0.5)
  Top 0.254: LED8.A 83.95,48.46 83,47.51 78.5,47.51 77.7,46.71 77.7,43.21 77,42.51 56,42.51 55,41.51 52,41.51 51,40.51 51,34.51 45,28.51 45,26.01 44.5,25.51 v42.2,25.51 | v34,19.51 34,16.21 33.5,15.71 32.1,15.71 IC1.15
  Bottom 0.254: v42.2,25.51 42.2,26.01 41.8,26.41 38.1,26.41 36.4,24.71 36.4,19.91 36,19.51 v34,19.51
N$33  (via drill 0.5)
  Top 0.254: LED7.A 79.3,45.51 78.3,44.51 78.3,17.01 77.8,16.51 v52.3,16.51 | v49,16.51 44.1,16.51 v43.5,15.91 | v36.9,13.51 36.45,13.96 33.85,13.96 33.65,13.76 28.35,13.76 28.1,14.01 28.1,16.51 27.7,16.91 25.97,16.91 IC1.1
  Bottom 0.254: v52.3,16.51 v49,16.51 | v43.5,15.91 43.5,14.41 43,13.91 37.3,13.91 v36.9,13.51
N$34  (via drill 0.5)
  Top 0.254: LED6.A 79.8,40.51 78.8,39.51 78.8,16.51 77.8,15.51 v52.3,15.51 | v36.3,12.61 36.2,12.51 28.1,12.51 27.6,13.01 27.6,15.31 27.2,15.71 25.95,15.71 IC1.2 | v44.6,15.81 48.7,15.81 v49,15.51
  Bottom 0.254: v36.3,12.61 43.1,12.61 44,13.51 44,15.31 44.5,15.81 v44.6,15.81 | v49,15.51 v52.3,15.51
N$36
  Top 0.254: IC2.7 36.17,23.33 37,22.51 43,22.51 44,21.51 44,17.56 LED9.A
N$37
  Top 0.254: IC2.6 34.91,23.6 37,21.51 41.5,21.51 42.5,20.51 42.5,14.01 43,13.51 LED10.A
N$38
  Top 0.254: IC2.5 33.63,23.87 37,20.51 40.5,20.51 41.6,19.41 41.6,9.91 42,9.51 LED11.A
N$39
  Top 0.254: IC2.4 32.36,24.14 37,19.51 39.6,19.51 40.5,18.61 40.5,6.01 41,5.51 LED12.A
N$40
  Top 0.254: IC2.3 31.09,23.38 30.67,22.96 27.55,22.96 26.73,23.78 26.73,34.94 27.99,36.1 36.15,36.1 36.58,36.53 36.58,50.09 37,50.51 LED13.A
N$41
  Top 0.254: IC2.2 29.82,24.13 29.2,23.51 27.84,23.51 27.19,24.16 27.19,34.72 27.99,35.52 36.29,35.52 37.01,36.24 37.01,45.52 38,46.51 LED14.A
N$42
  Top 0.254: IC2.1 28.27,25.44 27.7,26.01 27.7,34.51 28.24,35.05 36.62,35.05 37.44,35.87 37.44,41.95 38,42.51 LED15.A
N$43
  Top 0.254: IC2.15 29.82,33.33 31,34.51 37,34.51 38,35.51 38,37.51 39,38.51 LED16.A
SELECT_SW  (via drill 0.5)
  Top 0.254: C8.1 R19.1 4,14.26 4,12.51 4.5,12.01 12.1,12.01 12.7,11.41 v12.7,6.91 | ICSP1.1 60.5,3.01 60,2.51 25.5,2.51 25.1,2.91 25.1,4.51 v25.4,4.81 | v19.7,7.51 U3.4
  Bottom 0.254: v25.4,4.81 19,4.81 18.6,5.21 18.6,6.11 | 18.6,6.11 19.3,6.81 19.3,7.11 v19.7,7.51 | 18.6,6.11 17.7,6.11 16.9,6.91 v12.7,6.91
SR_CLOCK  (via drill 0.5)
  Top 0.254: IC2.11 34.91,29.6 36,28.51 37,28.51 39,26.51 v39,24.51 | v38.99,18.77 39.54,18.77 39.9,18.41 39.9,11.41 39,10.51 32.17,10.51 IC1.11 31.98,10.51 30,10.51 29.5,10.01 29.5,7.41 28,5.91 v25.4,5.91 | v19.3,5.71 19.2,5.71 19,5.91 19,7.11 18.6,7.51 U3.11
  Bottom 0.254: v39,24.51 v39,18.78 v38.99,18.77 | v19.3,5.71 24.8,5.71 v25.4,5.91
SR_DATA  (via drill 0.5)
  Top 0.254: ICSP1.5 70.5,4.01 70,3.51 62.3,3.51 v61.6,4.21 | v59.6,4.21 54.7,4.21 v54,3.51 | v51.6,3.91 51.3,3.91 51,3.61 34,3.61 | 34,3.61 27.6,3.61 v27,4.21 | v14.6,6.21 16.37,6.21 U3.12 | IC2.14 31.09,30.16 31.75,29.51 31.75,23.86 35.3,20.31 35.3,15.61 34.9,15.21 v34.1,15.21 | v33.9,8.01 33.9,3.71 34,3.61
  Bottom 0.254: v61.6,4.21 v59.6,4.21 | v54,3.51 52,3.51 v51.6,3.91 | v27,4.21 27,3.41 26.6,3.01 24.6,3.01 23.8,3.81 18,3.81 17.3,4.51 17.3,5.41 17,5.71 15.1,5.71 v14.6,6.21 | v34.1,15.21 33.5,15.21 33.1,14.81 33.1,8.81 v33.9,8.01
SR_LATCH  (via drill 0.5)
  Top 0.254: IC2.12 33.63,28.87 35,27.51 37.17,27.51 38.2,26.48 v38.2,23.51 v38.19,23.5 | v39,15.51 39,13.51 37.36,11.87 IC1.12 32.04,11.91 29.4,11.91 29,11.51 29,7.51 28.4,6.91 v25.4,6.91 | U3.3 20.27,6.24 v20,6.51
  Bottom 0.254: v39,15.51 38.19,16.32 v38.19,23.5 | v20,6.51 20,6.61 20.3,6.91 v25.4,6.91
VSENSE  (via drill 0.5)
  Top 0.254: U2.2 U2.1 22.93,30.58 v23,30.51 | U3.10 14.73,8.78 14.1,9.41 14.1,20.41 14.8,21.11 v15,21.11
  Bottom 0.254: v23,30.51 22,29.51 22,28.01 21.5,27.51 16,27.51 15,26.51 v15,21.11

### Text on the board
tPlace: Voltage | 9.6V | Charge | 8.4V | Discharge | 7.4V | 7.2V | Refresh | Charge / State | Current | Power | 100mA | 75mA | Set | 50mA | 15mA | ICSP
bPlace: Serial: